# EAGLE design appleii_blanking_plate (EAGLE 9.6.1)
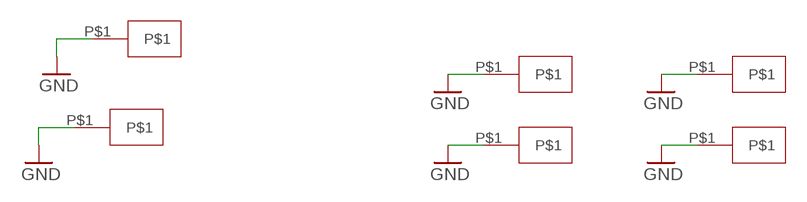
[diagram p0: schematic, sheet 1]

## Parts
U$1  EDGEPADEDGEPAD_20MM  [EDGEPAD_20MM]
U$2  EDGEPAD  [EDGEPAD]
U$3  EDGEPAD  [EDGEPAD]
U$4  EDGEPAD  [EDGEPAD]
U$5  EDGEPADEDGEPAD_20MM  [EDGEPAD_20MM]
U$13  EDGEPAD  [EDGEPAD]

## Nets
GND: U$1.P$1 U$2.P$1 U$3.P$1 U$4.P$1 U$5.P$1 U$13.P$1

## Library data of the parts
U$1-U$5 U$13 = atx4vc:EDGEPAD

## Board
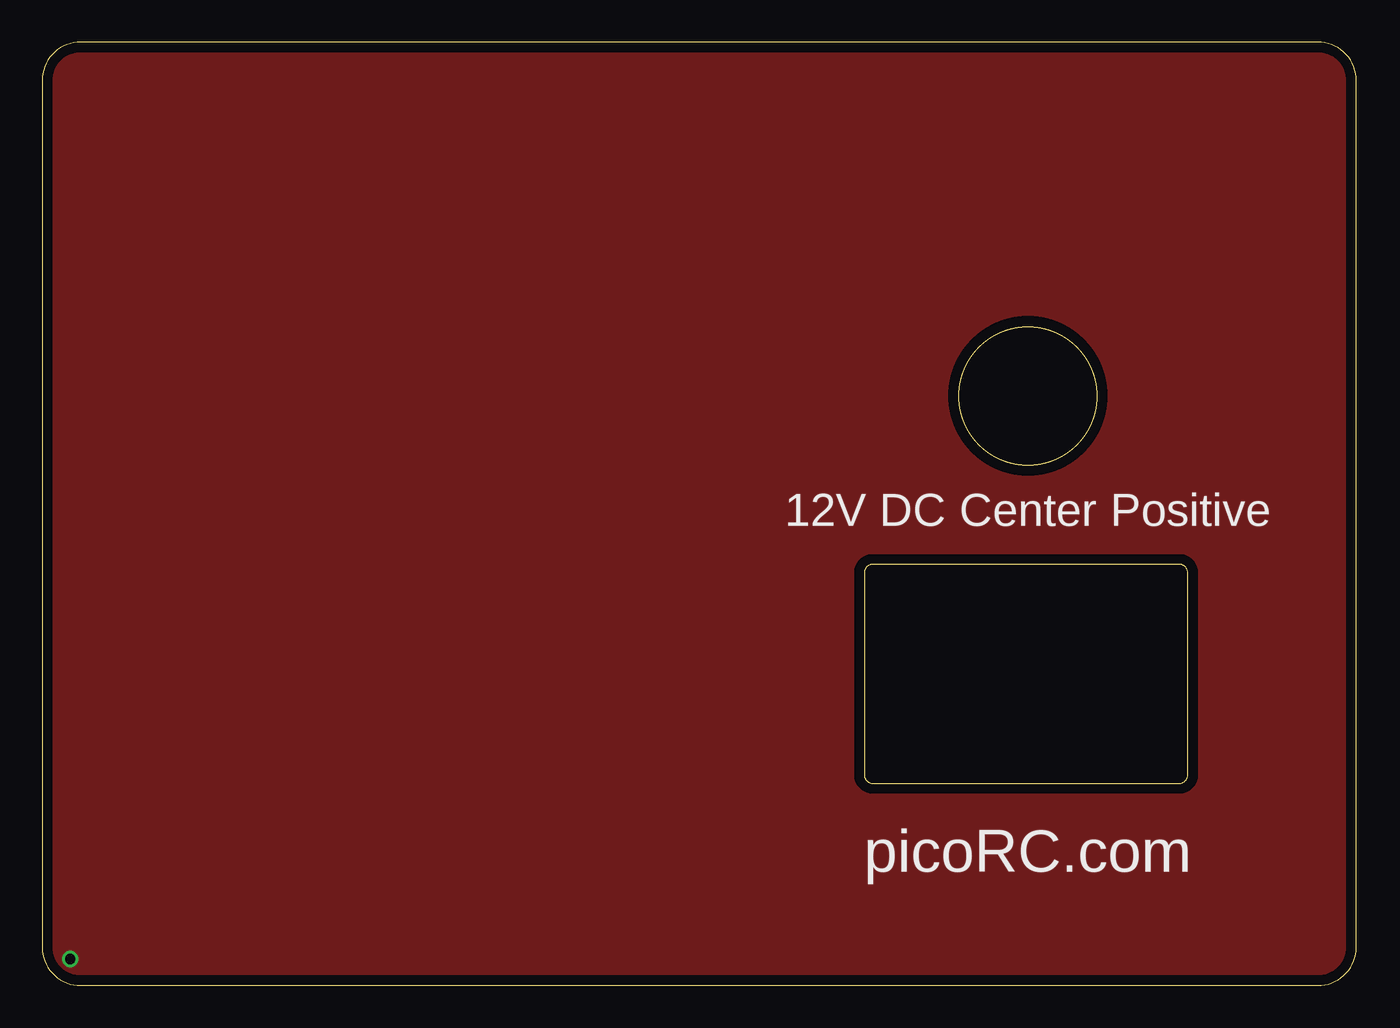
[diagram p1: board, top side]
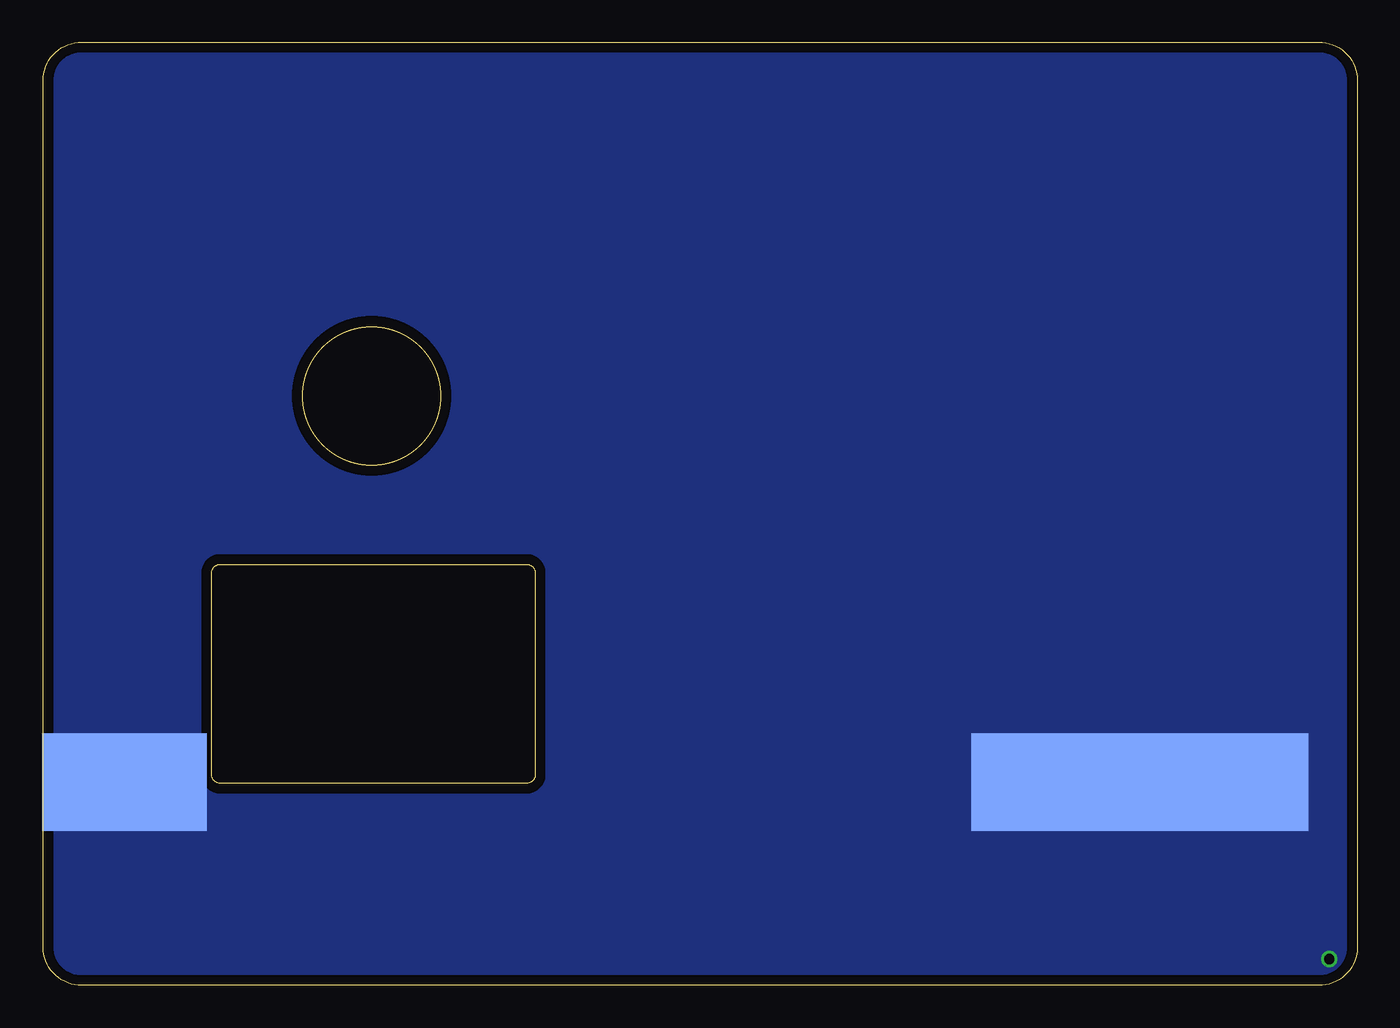
[diagram p2: board, bottom side, seen from below]

Size 78 x 56 mm. Coordinates in mm from the lower left corner, seen from the top.
Outline: 75.71,56 2.29,56 arc90 0,53.71 0,2.29 arc90 2.29,0 75.71,0 arc90 78,2.29 78,53.71 arc90 75.71,56
Outline: 67.49,25 49.31,25 arc90 48.8,24.49 48.8,12.51 arc90 49.31,12 67.49,12 arc90 68,12.51 68,24.49 arc90 67.49,25
Outline: circle at 58.5,35 radius 4.1
Copper layers (1*16): Top 0.035mm / dielectric 1.5mm / Bottom 0.035mm
Design rules "deku_2layer_6mil *": minimum track width 6mil, minimum drill 15mil, track to track 20mil, track to pad 6mil, pad to pad 6mil, via to via 6mil, smd to smd 6mil, copper to edge 10mil, drill to drill 6mil, minimum pad ring 7mil, minimum via ring 7mil, stop-mask expansion 4mil, vias tented up to drill 25mil, thermal gap 10mil

### Footprints (pad centres in the part's own frame; a part is rotated, then mirrored left to right if it is on the bottom)
EDGEPAD_20MM = smd 3 x 20: P$1 0,0
EDGEPAD = smd 3 x 5: P$1 0,0

### Placement (x,y rotation side)
U$1  12.91,13.46 270 bottom
U$2  70.8,13.46 270 bottom
U$3  75.56,10.67 270 bottom
U$4  70.8,10.67 270 bottom
U$5  12.91,10.67 270 bottom
U$13  75.56,13.46 90 bottom

### Tracks (layer width: path | path; a pad name or v marks a point on that pad's centre or on a via)
GND  (via drill 0.6)
  other vias: 1.67,1.57
  pour Top (isolate 0.61): 84,66 -9,66 -9,-9.06 84,-9.06
  pour Bottom (isolate 0.61): -6,63 -6,-6 87,-6 87,63

### Text on the board
tNames: 12V DC Center Positive | picoRC.com